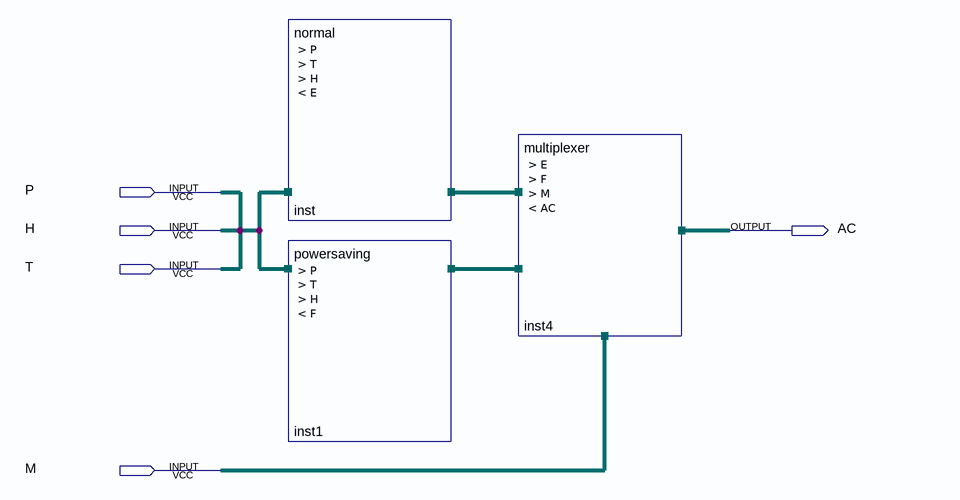
[diagram p0: schematic sheet]
// Quartus schematic main.bdf as structural Verilog: 3 symbols, 5 pins
module main (
  input  P,
  input  H,
  input  T,
  input  M,
  output AC
);

  wire E, F;

  normal inst (.P(P), .T(T), .H(H), .E(E));
  powersaving inst1 (.P(P), .T(T), .H(H), .F(F));
  multiplexer inst4 (.E(E), .F(F), .M(M), .AC(AC));
endmodule
